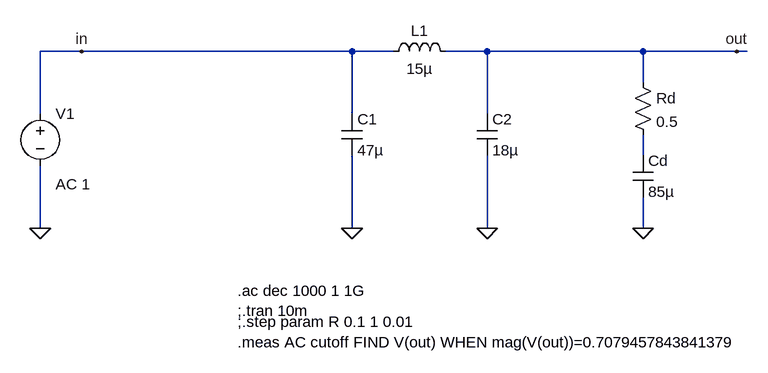
[diagram p0: schematic input filter.asc]
input filter.asc, the LTspice schematic file:
Version 4
SHEET 1 984 756
WIRE -192 32 -256 32
WIRE 224 32 -192 32
WIRE 288 32 224 32
WIRE 432 32 368 32
WIRE 672 32 432 32
WIRE 816 32 672 32
WIRE 832 32 816 32
WIRE 672 80 672 32
WIRE -256 128 -256 32
WIRE 224 128 224 32
WIRE 432 128 432 32
WIRE 672 192 672 160
WIRE -256 304 -256 208
WIRE 224 304 224 192
WIRE 432 304 432 192
WIRE 672 304 672 256
FLAG 432 304 0
FLAG -192 32 in
FLAG 816 32 out
FLAG -256 304 0
FLAG 224 304 0
FLAG 672 304 0
SYMBOL ind 272 48 R270
WINDOW 0 32 56 VTop 2
WINDOW 3 5 56 VBottom 2
SYMATTR InstName L1
SYMATTR Value 15µ
SYMATTR SpiceLine Rser=21m Cpar=5.85p
SYMBOL voltage -256 112 R0
WINDOW 123 24 124 Left 2
WINDOW 39 24 44 Left 2
WINDOW 3 24 152 Left 2
SYMATTR Value2 AC 1
SYMATTR Value ""
SYMATTR InstName V1
SYMBOL cap 416 128 R0
SYMATTR InstName C2
SYMATTR Value 18µ
SYMATTR SpiceLine Lser=100p
SYMBOL cap 208 128 R0
SYMATTR InstName C1
SYMATTR Value 47µ
SYMATTR SpiceLine Lser=100p
SYMBOL cap 656 192 R0
SYMATTR InstName Cd
SYMATTR Value 85µ
SYMATTR SpiceLine Rser=0.5
SYMBOL res 656 64 R0
SYMATTR InstName Rd
SYMATTR Value 0.5
TEXT 48 400 Left 2 !.ac dec 1000 1 1G\n;.tran 10m
TEXT 48 448 Left 2 !;.step param R 0.1 1 0.01\n.meas AC cutoff FIND V(out) WHEN mag(V(out))=0.7079457843841379

The netlist it stands for:
* input filter.asc
L1 in out 15µ Rser=21m Cpar=5.85p
V1 in 0 AC 1
C2 out 0 18µ Lser=100p
C1 in 0 47µ Lser=100p
Cd N001 0 85µ Rser=0.5
Rd out N001 0.5
.ac dec 1000 1 1G
;.tran 10m
;.step param R 0.1 1 0.01
.meas AC cutoff FIND V(out) WHEN mag(V(out))=0.7079457843841379
.backanno
.end